# EAGLE design moodlamp (EAGLE 5.11)
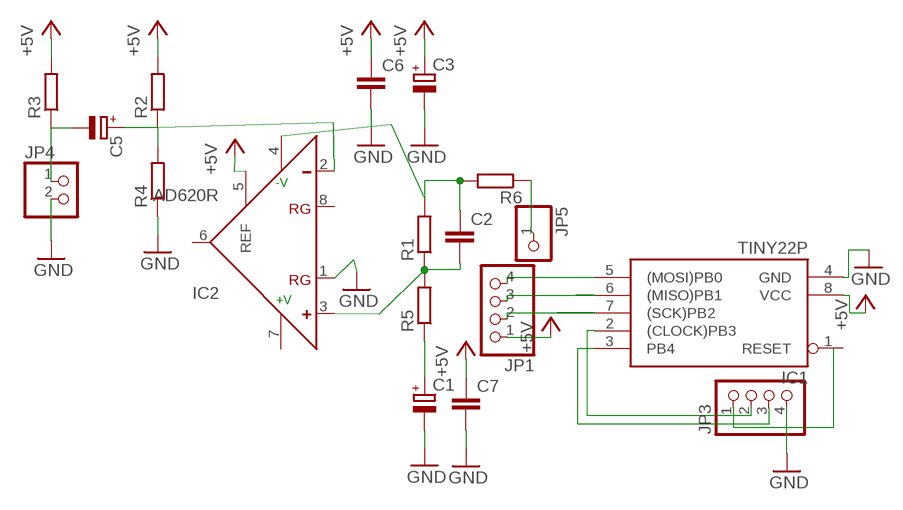
[diagram p0: schematic, sheet 1]

## Parts
C1  CPOL-EUC/6032-28R  [C/6032-28R]
C2  C-EUC0805  [C0805]
C3  CPOL-EUC/6032-28R  [C/6032-28R]
C5  CPOL-EUSMCP  [SMC_P]
C6  C-EUC0805  [C0805]
C7  C-EUC0805  [C0805]
IC1  TINY22P  [DIL08]
IC2  AD620R  [SO8]
JP1  PINHD-1X4  [1X04]
JP3  PINHD-1X4  [1X04]
JP4  PINHD-1X2  [1X02]
JP5  PINHD-1X1  [1X01]
R1  R-EU_M0805  [M0805]
R2  R-EU_M0805  [M0805]
R3  R-EU_M0805  [M0805]
R4  R-EU_M0805  [M0805]
R5  R-EU_M0805  [M0805]
R6  R-EU_M0805  [M0805]

## Nets
+5V: C3.+ C6.1 C7.1 IC1.8(VCC) IC2.5(REF) JP1.1 R2.2 R3.2
GND: C1.- C3.- C6.2 C7.2 IC1.4(GND) IC2.1(RG) JP3.4 JP4.2 R4.1
N$1: C5.- JP4.1 R3.1
N$2: C5.+ IC2.2(-) R2.1 R4.2
N$3: C2.1 IC2.4(-V) R1.2 R6.2
N$4: C2.2 IC2.3(+) R1.1 R5.2
N$5: C1.+ R5.1
N$6: IC1.3(PB4) JP3.3
N$7: JP3.1
N$8: IC1.7((SCK)PB2) JP1.2
N$9: IC1.6((MISO)PB1) JP1.3
N$10: IC1.5((MOSI)PB0) JP1.4
N$11: IC1.2((CLOCK)PB3) JP3.2
N$12: JP5.1 R6.1
Unconnected: IC1.1(RESET) IC2.6(OUT) IC2.8(RG)

## Power pins joined to a net without a drawn wire
+V: IC2.7(+V)

## Library data of the parts
C1 C3 C5 = rcl:CPOL-EU: POLARIZED CAPACITOR, European symbol
C2 C6 C7 = rcl:C-EU: CAPACITOR, European symbol
IC1 = atmel:TINY22: MICROCONTROLLER 1K ROM 128 bytes RAM 128 bytes EEPROM; OC_FARNELL: unknown; OC_NEWARK: unknown
IC2 = analog-devices:AD620: Low Cost, Low Power, Instrumentation Amplifier Source: http://www.analog.com/UploadedFiles/Data_Sheets/37793330023930AD620_e.pdf; MPN: AD620AR; OC_FARNELL: 1464424; OC_NEWARK: 05F7109
JP1 JP3 = pinhead:PINHD-1X4: PIN HEADER
JP4 = pinhead:PINHD-1X2: PIN HEADER
JP5 = pinhead:PINHD-1X1: PIN HEADER
R1-R6 = rcl:R-EU_: RESISTOR, European symbol

## Board
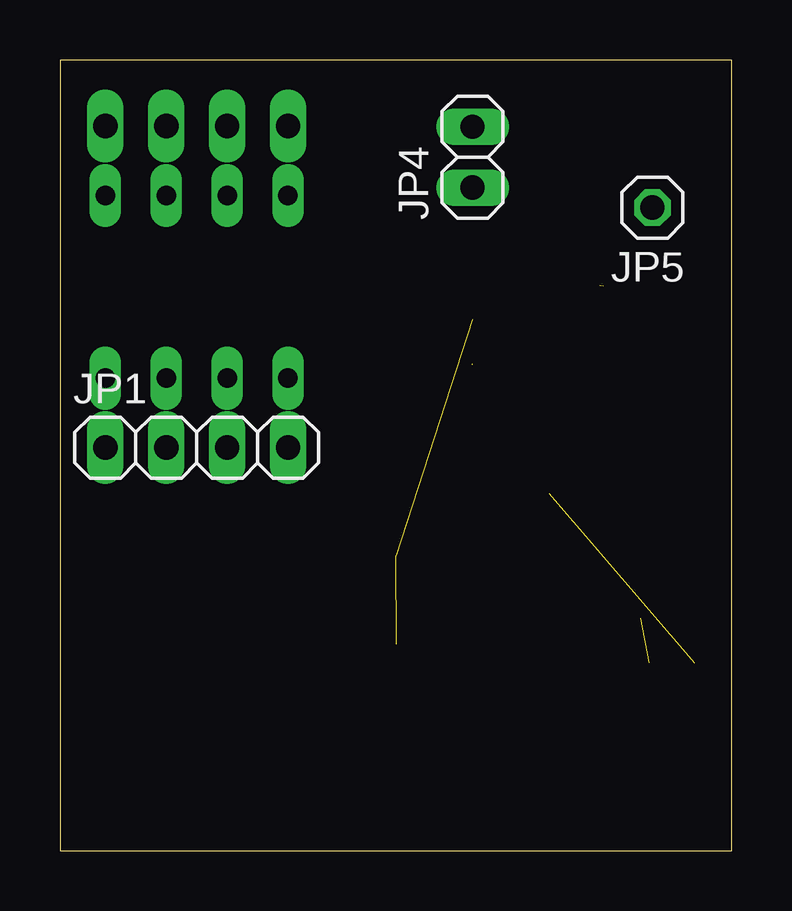
[diagram p1: board, top side]
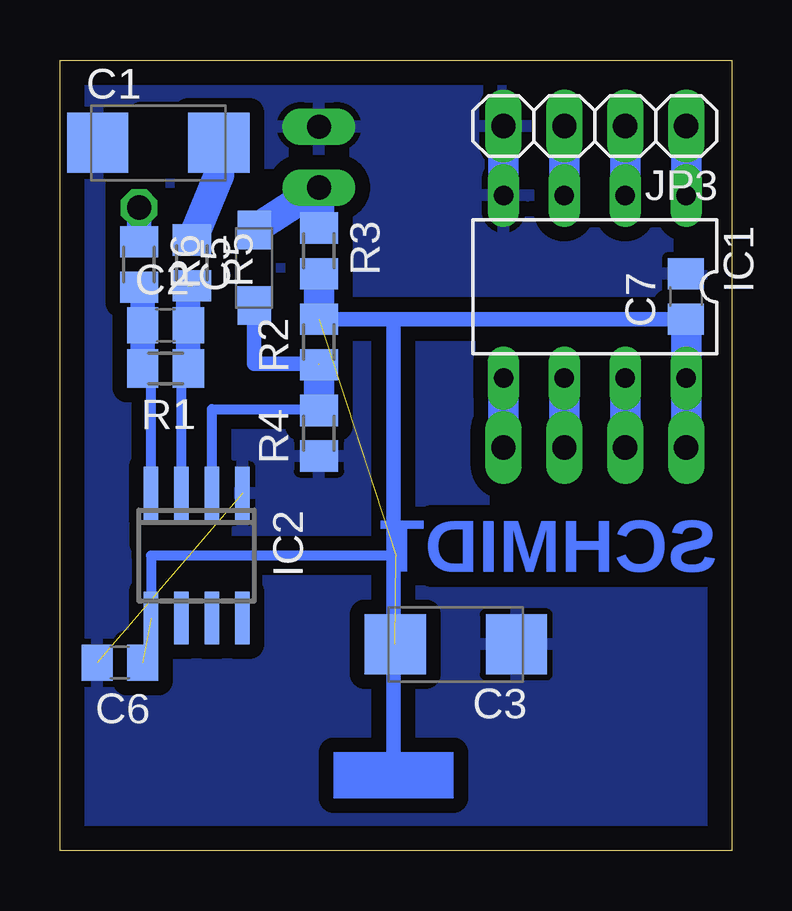
[diagram p2: board, bottom side, seen from below]

Size 28 x 32.95 mm. Coordinates in mm from the lower left corner, seen from the top.
Outline: 0,0 28,0 28,32.95 0,32.95 0,0
Copper layers (1*16): Top 0.035mm / dielectric 1.5mm / Bottom 0.035mm
Design rules "default": minimum track width 10mil, minimum drill 24mil, track to track 8mil, track to pad 8mil, pad to pad 8mil, via to via 8mil, smd to smd 8mil, copper to edge 40mil, drill to drill 8mil, minimum pad ring 10mil, minimum via ring 8mil, stop-mask expansion 4mil, vias tented up to drill 0mil, thermal gap 10mil
bRestrict: area 23.2,28.6 to 24.6,30.6; area 25.1,25.7 to 25.5,27.9; area 2.1,14 to 9.3,15.3; area 8,31.3 to 8.8,32.2; area 8.2,28.2 to 8.8,29; area 20.4,19 to 21.7,21.7; area 0.9,24.8 to 1.8,25.7; area 23.8,12.8 to 24.5,13.4

### Footprints (pad centres in the part's own frame; a part is rotated, then mirrored left to right if it is on the bottom)
C/6032-28R = smd 2.55 x 2.5: + 2.525,0; - -2.525,0
C0805 = smd 1.3 x 1.5: 1 -0.95,0; 2 0.95,0
SMC_P = smd 1.6 x 1.4: + -1.575,0; - 1.575,0
DIL08 = drill 0.813 long: 1 -3.81,-3.81; 2 -1.27,-3.81; 3 1.27,-3.81; 4 3.81,-3.81; 5 3.81,3.81; 6 1.27,3.81; 7 -1.27,3.81; 8 -3.81,3.81
SO8 = smd 0.6 x 2.2: 1 -1.905,-2.6; 2 -0.635,-2.6; 3 0.635,-2.6; 4 1.905,-2.6; 5 1.905,2.6; 6 0.635,2.6; 7 -0.635,2.6; 8 -1.905,2.6
1X04 = drill 1.016 long: 1 -3.81,0; 2 -1.27,0; 3 1.27,0; 4 3.81,0
1X02 = drill 1.016 long: 1 -1.27,0; 2 1.27,0
1X01 = drill 1.016 octagon: 1 0,0
M0805 = smd 1.3 x 1.6: 1 -0.95,0; 2 0.95,0

### Placement (x,y rotation side)
C1  23.9,29.5 0 bottom
C2  23.6,21.9 0 bottom
C3  11.5,8.6 180 bottom
C5  19.9,24.3 90 bottom
C6  25.5,7.84 180 bottom
C7  1.9,23.1 90 bottom
IC1  5.7,23.5 180 bottom
IC2  22.3,12.3 180 bottom
JP1  5.7,16.8 0 top
JP3  5.7,30.2 180 bottom
JP4  17.2,28.9 90 top
JP5  24.7,26.8 180 top
R1  23.6,20.1 180 bottom
R2  17.2,21.2 90 bottom
R3  17.2,25 270 bottom
R4  17.2,17.4 90 bottom
R5  22.5,24.5 270 bottom
R6  24.7,24.43 270 bottom

### Tracks (layer width: path | path; a pad name or v marks a point on that pad's centre or on a via)
+5V  (3 unrouted)
  Bottom 0.406: IC2.5 24.2,12.3 14,12.3
  Bottom 0.61: C7.1 R2.2
  Bottom 1.27: JP1.1 IC1.8 1.89,21.65 C7.1 | R2.2 R3.2
GND  (1 unrouted)
  Bottom 1.27: IC1.4 JP3.4
  pour Bottom (isolate 0.61): 0,33 28,33 28,0 0,0
N$1
  Bottom 1.27: R3.1 JP4.1 C5.-
N$2  (1 unrouted)
  Bottom 0.406: IC2.2 21.66,18.4 17.2,18.4
  Bottom 0.61: C5.+ 19.9,20.3 17.2,20.3
  Bottom 1.27: R4.2 17.2,18.4 R2.1
N$3
  Bottom 0.406: IC2.4 24.2,20.2 R1.2
  Bottom 1.016: R1.2 C2.1 24.55,23.55 R6.2
N$4  (1 unrouted)
  Bottom 0.406: IC2.3 22.93,20.2 R1.1 22.6,20.2
  Bottom 1.016: R1.1 C2.2 22.65,23.53
N$5
  Bottom 1.27: R5.1 21.38,28.18 C1.+
N$6
  Bottom 1.27: IC1.3 JP3.3
N$7
  Bottom 1.27: 1.89,27.35 JP3.1
N$8
  Bottom 1.27: JP1.2 IC1.7
N$9
  Bottom 1.27: JP1.3 IC1.6
N$10
  Bottom 1.27: JP1.4 IC1.5
N$11
  Bottom 1.27: IC1.2 JP3.2
N$12
  Bottom 1.016: R6.1 JP5.1
VCC
  Bottom 0.61: 14.1,3.7 14.1,22.1
(copper drawn outside any net)
  shapes: Bottom area x1

### Text on the board
Bottom: SCHMIDT